# EAGLE board mcat-4cu-b-V2J (EAGLE 6.6.0)
DATECODE: 201406201445; PN: MCAT-4CU-B; REV: 2J
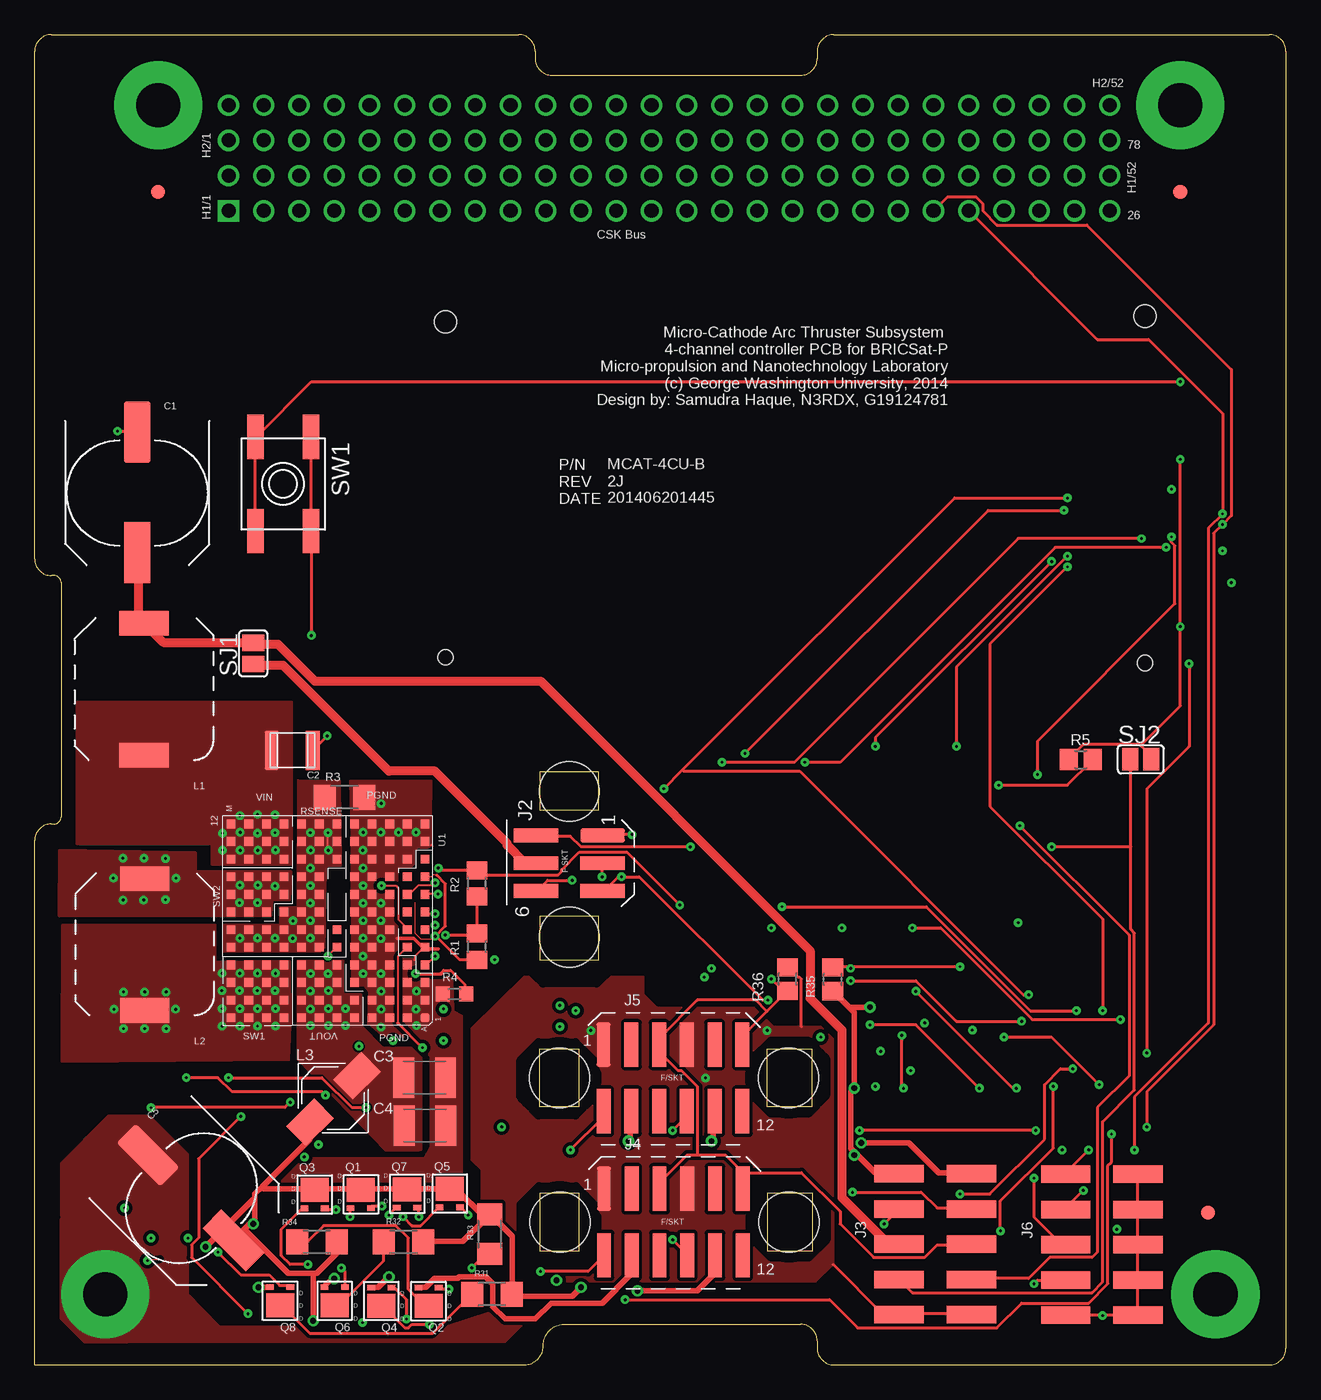
[diagram p5: board, top side]
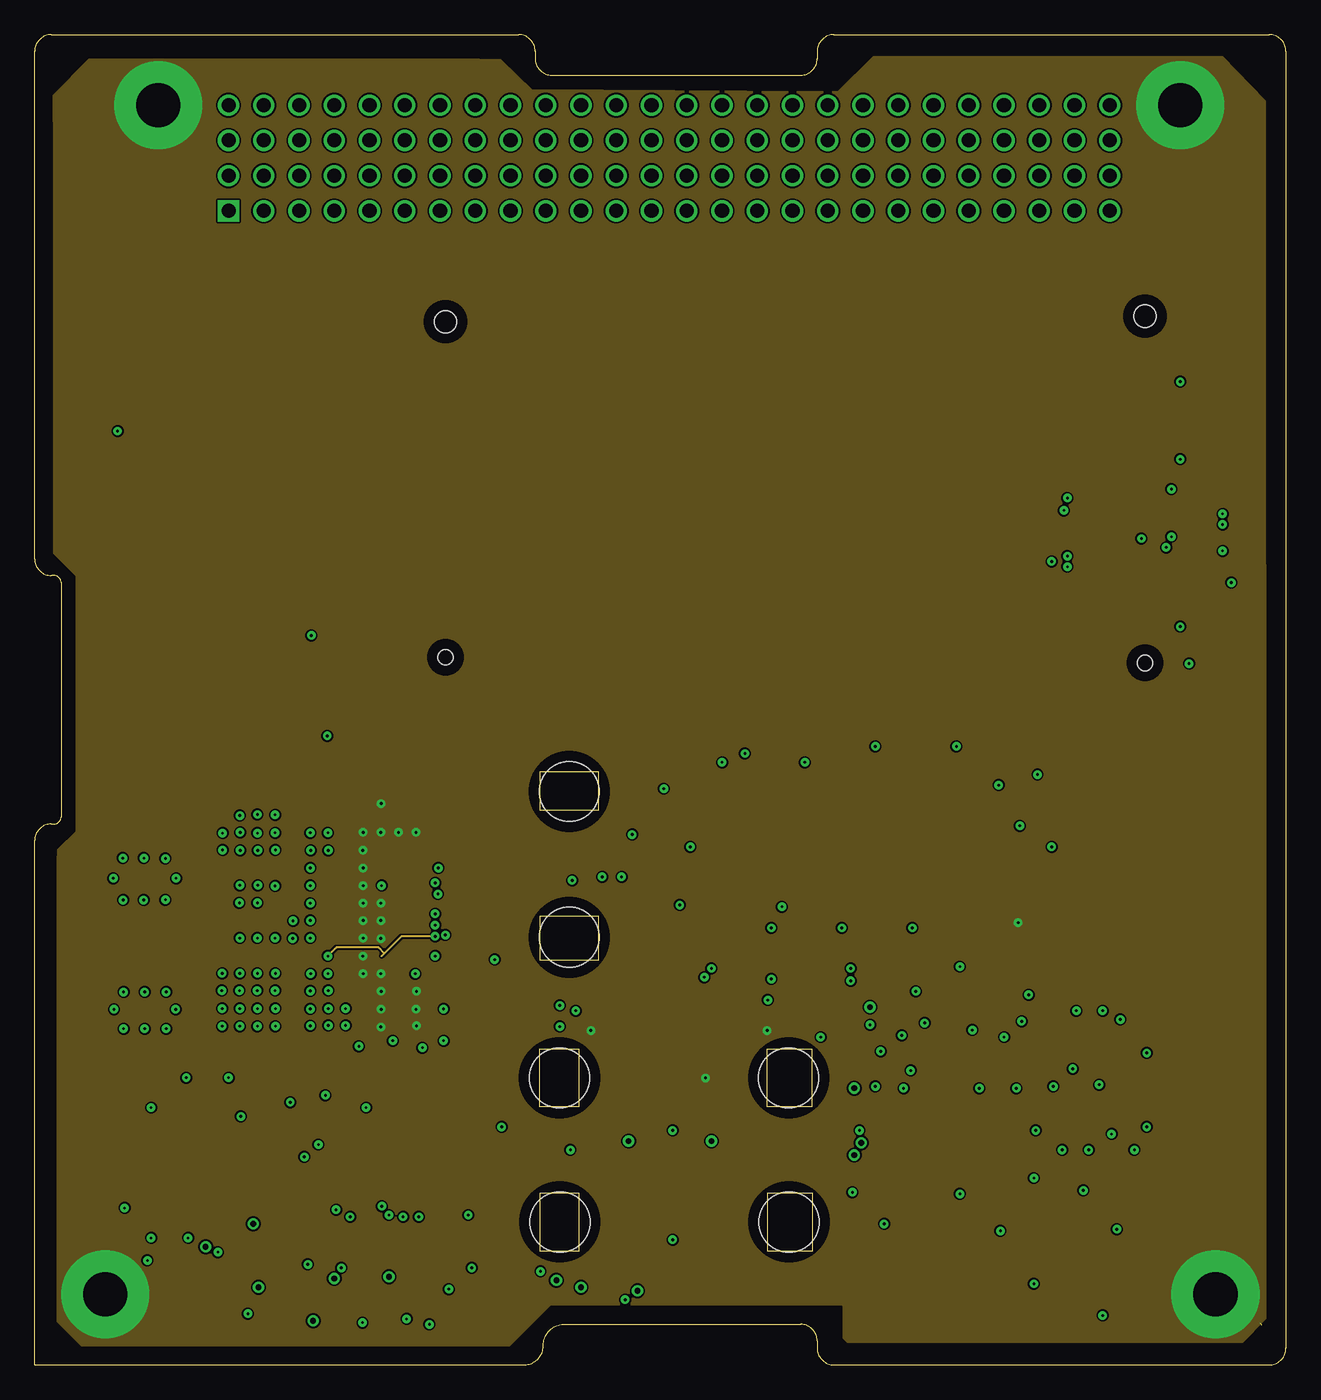
[diagram p6: board, inner layer GND_PLANE]
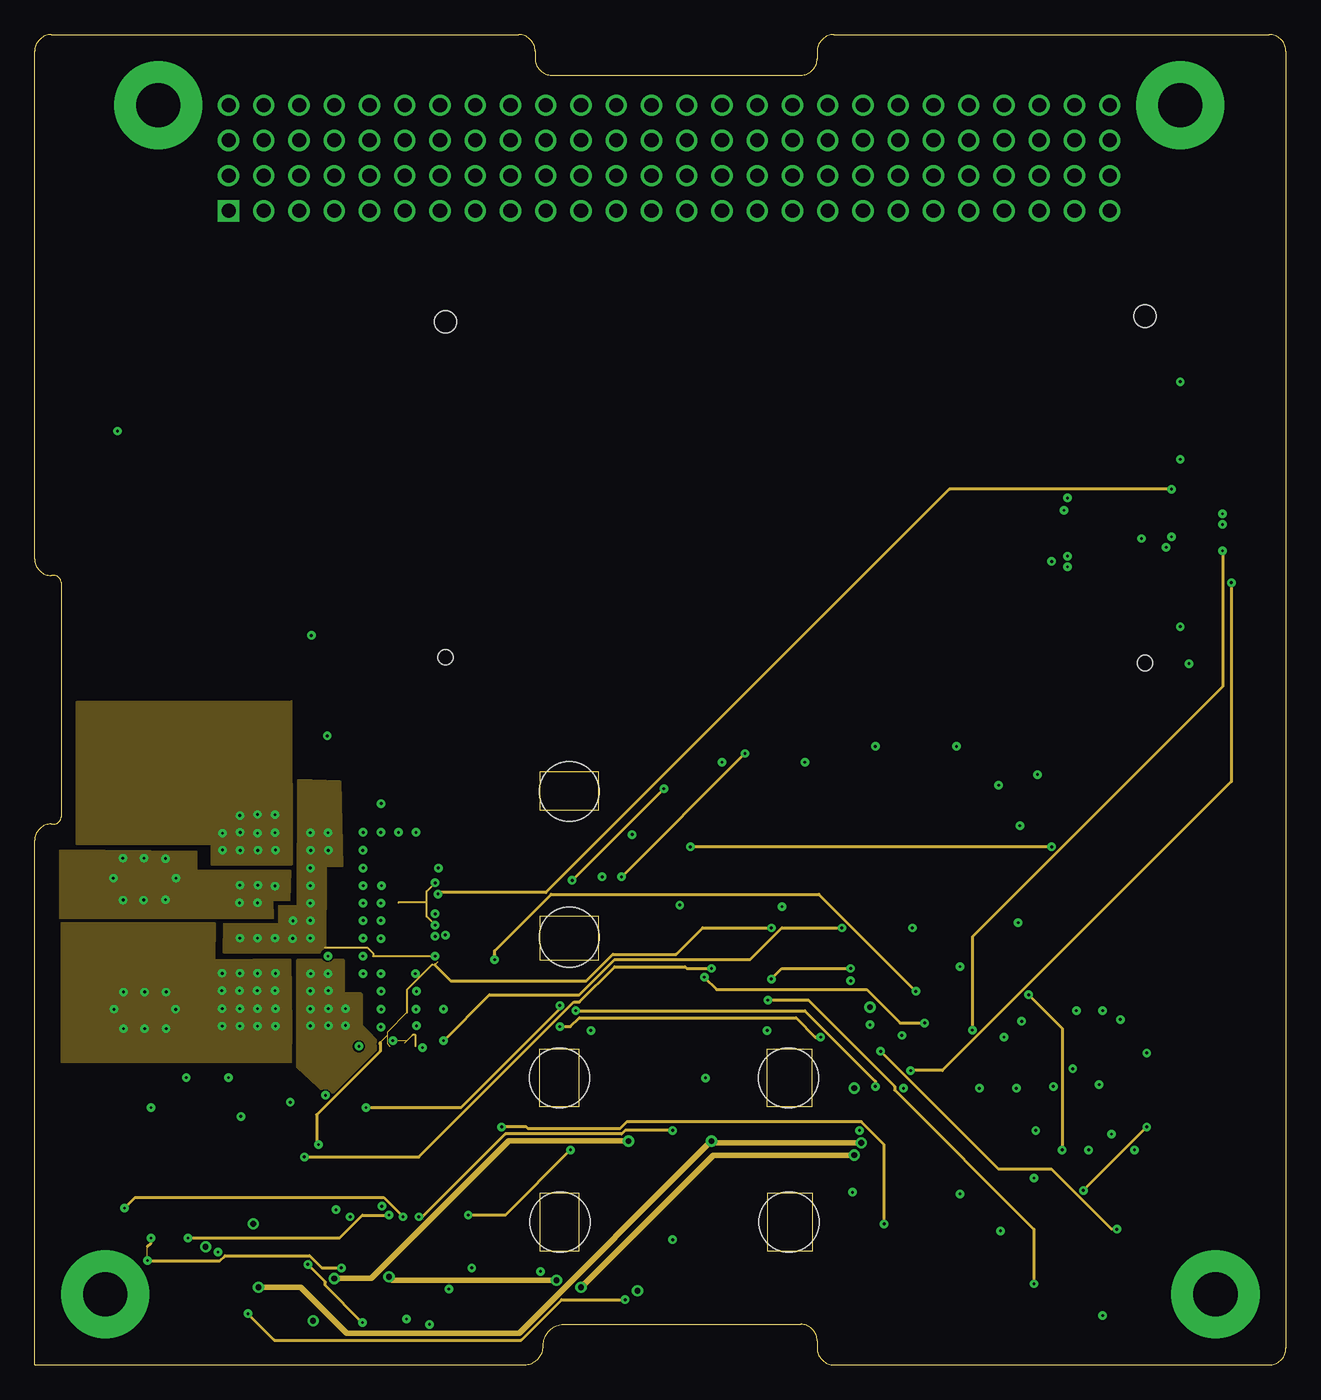
[diagram p7: board, inner layer GND_PLANE/TRACE]
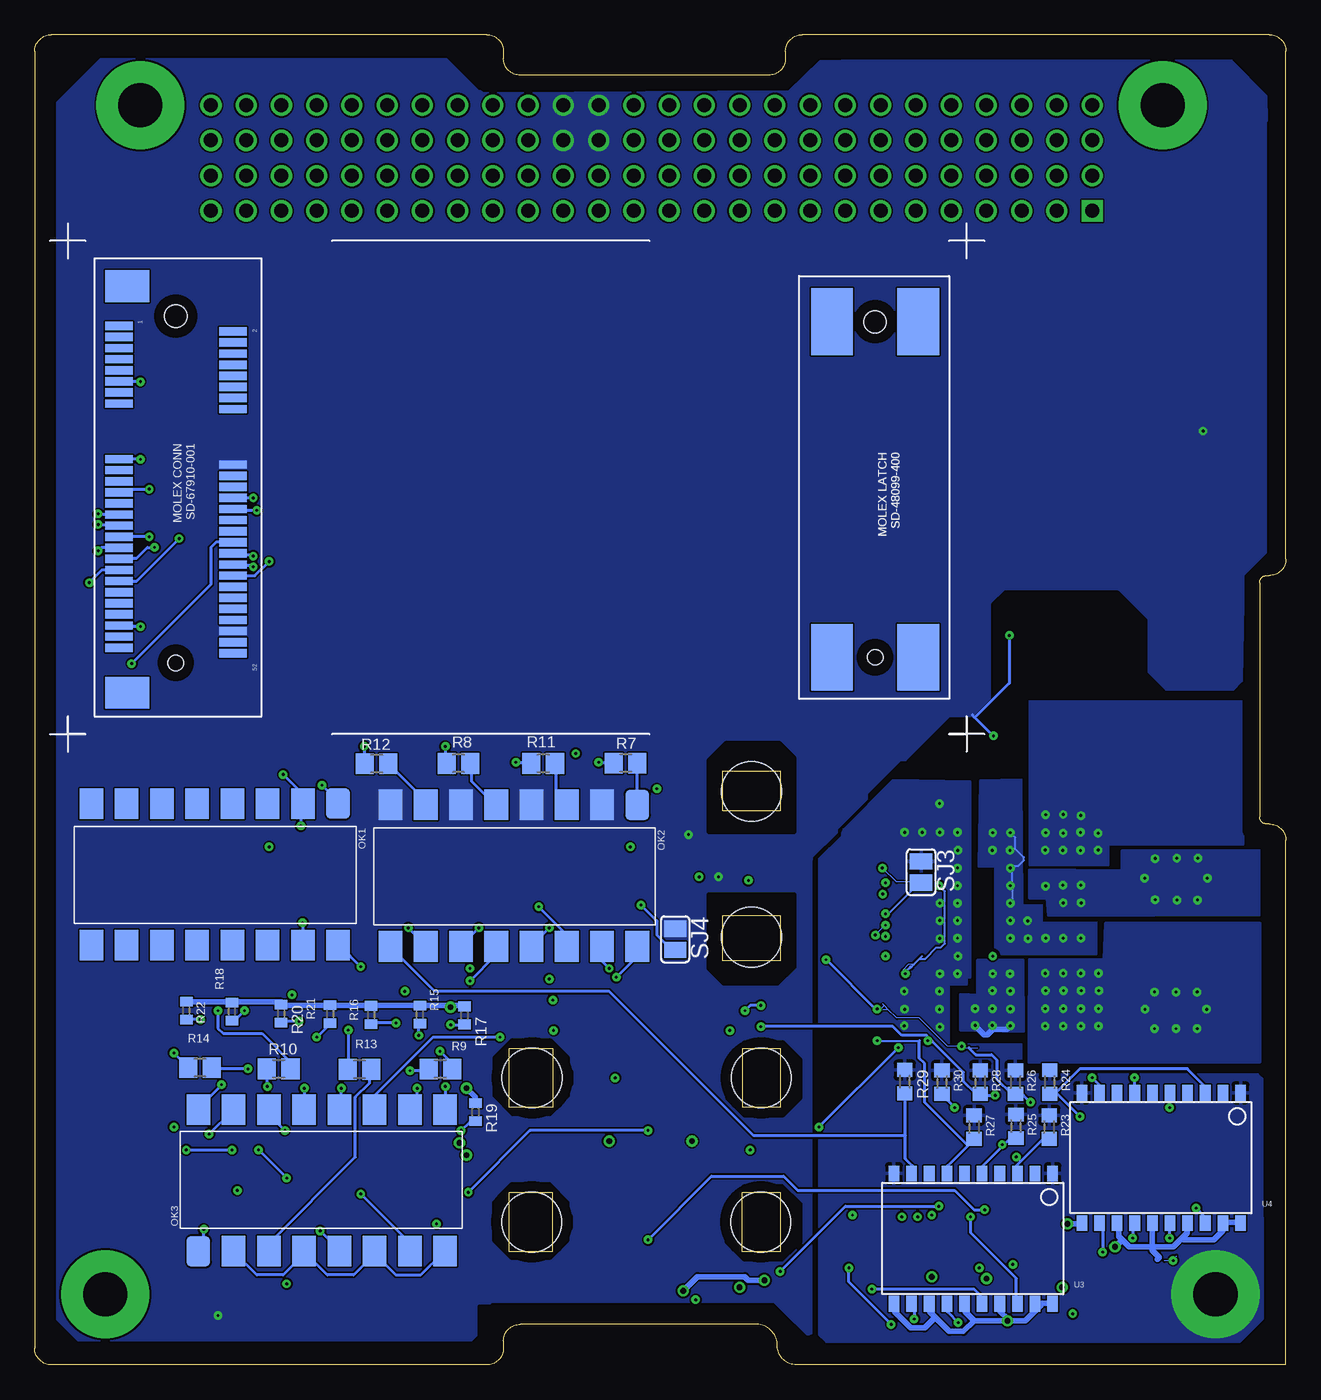
[diagram p8: board, bottom side, seen from below]

Size 90.17 x 95.89 mm. Coordinates in mm from the lower left corner, seen from the top.
Outline: 0,0 34.87,0 35.28,0 arc90 36.65,1.37 arc-90 38.12,2.92 55.19,2.92 arc-90 56.39,1.73 56.39,1.19 arc90 57.58,0 88.98,0 arc90 90.17,1.19 90.17,94.69 arc90 88.98,95.89 57.58,95.89 arc90 56.39,94.69 56.39,94.16 arc-90 55.19,92.96 37.26,92.96 arc-90 36.07,94.16 36.07,94.69 arc90 34.87,95.89 1.19,95.89 arc90 0,94.69 0,58.09 arc90 1.19,56.9 1.4,56.9 arc-90 1.91,56.39 1.91,39.5 arc-90 1.4,38.99 1.19,38.99 arc90 0,37.8 0,0
Copper layers (1+2*15+16): Top 0.0174mm / dielectric 3.5mil / GND_PLANE 0.0174mm / dielectric 47mil / GND_PLANE/TRACE 0.0174mm / dielectric 3.5mil / Bottom 0.0174mm
Design rules "mcat-4cu-b-v2g *": minimum track width 8mil, minimum drill 8mil, track to track 5mil, track to pad 5mil, pad to pad 5mil, via to via 5mil, smd to smd 5mil, copper to edge 30mil, drill to drill 10mil, minimum pad ring 8mil, minimum via ring 8mil, stop-mask expansion 0mil, vias tented up to drill 8mil, thermal gap 10mil
Net classes: 1 vout1: width 0.381 mm, drill 0.406 mm; 2 vin2: width 0.635 mm, drill 0.66 mm
tRestrict: 27 lines
bRestrict: 31 lines

## Footprints (pad centres in the part's own frame; a part is rotated, then mirrored left to right if it is on the bottom)
OS-CON-SVPF-F12 = smd 1.9 x 4.4: A1 0,-4.3; K1 0,4.4
MLCC-X7R-1210 = smd 1 x 2.8: 1 1.6,0.05; 2 -1.35,0.05
C1210K = smd 1.5 x 2.9: 1 -1.5,0; 2 1.5,0
FIDUCIAL_1MM = smd 1 x 1: 1 0,0
CSK-BUS-PKG = drill 1.016 pad 1.524 square: 1 -29.21,-3.81 | drill 1.016 pad 1.524: 2 -29.21,-1.27; 3 -26.67,-3.81; 4 -26.67,-1.27; 5 -24.13,-3.81; 6 -24.13,-1.27; 7 -21.59,-3.81; 8 -21.59,-1.27; 9 -19.05,-3.81; 10 -19.05,-1.27; 11 -16.51,-3.81; 12 -16.51,-1.27; 13 -13.97,-3.81; 14 -13.97,-1.27; 15 -11.43,-3.81; 16 -11.43,-1.27; 17 -8.89,-3.81; 18 -8.89,-1.27; 19 -6.35,-3.81; 20 -6.35,-1.27; 21 -3.81,-3.81; 22 -3.81,-1.27; 23 -1.27,-3.81; 24 -1.27,-1.27; 25 1.27,-3.81; 26 1.27,-1.27; 27 3.81,-3.81; 28 3.81,-1.27; 29 6.35,-3.81; 30 6.35,-1.27; 31 8.89,-3.81; 32 8.89,-1.27; 33 11.43,-3.81; 34 11.43,-1.27; 35 13.97,-3.81; 36 13.97,-1.27; 37 16.51,-3.81; 38 16.51,-1.27; 39 19.05,-3.81; 40 19.05,-1.27; 41 21.59,-3.81; 42 21.59,-1.27; 43 24.13,-3.81; 44 24.13,-1.27; 45 26.67,-3.81; 46 26.67,-1.27; 47 29.21,-3.81; 48 29.21,-1.27; 49 31.75,-3.81; 50 31.75,-1.27; 51 34.29,-3.81; 52 34.29,-1.27; 53 -29.21,1.27; 54 -29.21,3.81; 55 -26.67,1.27; 56 -26.67,3.81; 57 -24.13,1.27; 58 -24.13,3.81; 59 -21.59,1.27; 60 -21.59,3.81; 61 -19.05,1.27; 62 -19.05,3.81; 63 -16.51,1.27; 64 -16.51,3.81; 65 -13.97,1.27; 66 -13.97,3.81; 67 -11.43,1.27; 68 -11.43,3.81; 69 -8.89,1.27; 70 -8.89,3.81; 71 -6.35,1.27; 72 -6.35,3.81; 73 -3.81,1.27; 74 -3.81,3.81; 75 -1.27,1.27; 76 -1.27,3.81; 77 1.27,1.27; 78 1.27,3.81; 79 3.81,1.27; 80 3.81,3.81; 81 6.35,1.27; 82 6.35,3.81; 83 8.89,1.27; 84 8.89,3.81; 85 11.43,1.27; 86 11.43,3.81; 87 13.97,1.27; 88 13.97,3.81; 89 16.51,1.27; 90 16.51,3.81; 91 19.05,1.27; 92 19.05,3.81; 93 21.59,1.27; 94 21.59,3.81; 95 24.13,1.27; 96 24.13,3.81; 97 26.67,1.27; 98 26.67,3.81; 99 29.21,1.27; 100 29.21,3.81; 101 31.75,1.27; 102 31.75,3.81; 103 34.29,1.27; 104 34.29,3.81
M80-68106 = smd 1 x 3.2: 1 -2,2.4; 2 0,2.4; 3 2,2.4; 4 -2,-2.4; 5 0,-2.4; 6 2,-2.4 | hole 4.318: -5.175,0; 5.335,0
AMPMODU-SMT-PIN-HEADER-5X2 = smd 1.27 x 3.556: 1 -4.826,2.54; 2 -2.286,2.54; 3 0.254,2.54; 4 2.794,2.54; 5 5.334,2.54; 6 -4.826,-2.667; 7 -2.286,-2.667; 8 0.254,-2.667; 9 2.794,-2.667; 10 5.334,-2.667
M80-68112 = smd 1 x 3.2: 1 0,2.4; 2 2,2.4; 3 4,2.4; 4 6,2.4; 5 8,2.4; 6 10,2.4; 7 0,-2.4; 8 2,-2.4; 9 4,-2.4; 10 6,-2.4; 11 8,-2.4; 12 10,-2.4 | hole 4.318: -3.175,0; 13.335,0
LATCH_SD-48099-400 = smd 4.8 x 3: P$3 12.25,24.6; P$4 -11.95,24.6; P$5 -11.95,30.8; P$6 12.25,30.8 | hole 1.6: -11.95,27.7 | hole 1.1: 12.25,27.7
CONN_SD-67910-001 = smd 0.6 x 2: 1 -11.65,-26.8; 2 -11.248,-18.576; 3 -10.85,-26.8; 4 -10.447,-18.576; 5 -10.05,-26.8; 6 -9.648,-18.576; 7 -9.25,-26.8; 8 -8.848,-18.576; 9 -8.45,-26.8; 10 -8.047,-18.576; 11 -7.65,-26.8; 12 -7.247,-18.576; 13 -6.85,-26.8; 14 -6.447,-18.576; 15 -6.05,-26.8; 16 -5.647,-18.576; 17 -2.05,-26.8; 18 -1.647,-18.576; 19 -1.25,-26.8; 20 -0.848,-18.576; 21 -0.45,-26.8; 22 -0.048,-18.576; 23 0.35,-26.8; 24 0.752,-18.576; 25 1.15,-26.8; 26 1.552,-18.576; 27 1.95,-26.8; 28 2.353,-18.576; 29 2.75,-26.8; 30 3.152,-18.576; 31 3.55,-26.8; 32 3.953,-18.576; 33 4.35,-26.8; 34 4.753,-18.576; 35 5.15,-26.8; 36 5.553,-18.576; 37 5.95,-26.8; 38 6.353,-18.576; 39 6.75,-26.8; 40 7.152,-18.576; 41 7.55,-26.8; 42 7.952,-18.576; 43 8.35,-26.8; 44 8.752,-18.576; 45 9.15,-26.8; 46 9.553,-18.576; 47 9.95,-26.8; 48 10.352,-18.576; 49 10.75,-26.8; 50 11.152,-18.576; 51 11.55,-26.8; 52 11.953,-18.576 | smd 2.3 x 3.2: P$1 -14.5,-26.2; P$2 14.8,-26.2 | hole 1.6: -12.35,-22.7 | hole 1.1: 12.65,-22.7
MSS1048 = smd 3.56 x 1.78: 1 5,9.85; 2 5,0.35
SERIES-POWER-INDUCTORS = smd 2.85 x 2 rotated 45: 1 1.75,1.6; 2 -1.65,-1.75
PS2501L-4 = smd 2.2 x 1.7: 1 -1.6,19.03; 2 -1.6,16.49; 3 -1.6,13.95; 4 -1.6,11.41; 5 -1.6,8.87; 6 -1.6,6.33; 7 -1.6,3.79; 8 -1.6,1.25; 9 8.6,1.25; 10 8.6,3.79; 11 8.6,6.33; 12 8.6,8.87; 13 8.6,11.41; 14 8.6,13.95; 15 8.6,16.49; 16 8.6,19.03
1206-8-CHIPFET = smd 2.032 x 1.727: D 0,1.321 | smd 0.559 x 0.406: G -0.736,0; S 0.736,0
R0805 = smd 1.3 x 1.5: 1 -0.95,0; 2 0.95,0
R1206 = smd 1.6 x 1.803: 1 -1.422,0; 2 1.422,0
R0603 = smd 1 x 1.1: 1 -0.85,0; 2 0.85,0
R0805' = smd 1.3 x 1.5: 1 -0.85,0; 2 0.85,0
R0402 = smd 0.7 x 0.9: 1 -0.65,0; 2 0.65,0
SJ = smd 1.168 x 1.6: 1 -0.762,0; 2 0.762,0
EVQ-Q2 = smd 3.2 x 1.2: A -3.4,-2; A' 3.4,-2; B -3.4,2; B' 3.4,2
LGA-141-LTC-05-08-1840-B = smd 0.63 x 0.63: A1 -7.116,-10.192; A2 -5.846,-10.192; A3 -4.576,-10.192; A4 -3.306,-10.192; A5 -2.036,-10.192; A6 -0.766,-10.192; A7 0.504,-10.192; A8 1.774,-10.192; A9 3.044,-10.192; A10 4.314,-10.192; A11 5.584,-10.192; A12 6.854,-10.192; B1 -7.116,-8.922; B2 -5.846,-8.922; B3 -4.576,-8.922; B4 -3.306,-8.922; B5 -2.036,-8.922; B6 -0.766,-8.922; B7 0.504,-8.922; B8 1.774,-8.922; B9 3.044,-8.922; B10 4.314,-8.922; B11 5.584,-8.922; B12 6.854,-8.922; C1 -7.116,-7.652; C2 -5.846,-7.652; C3 -4.576,-7.652; C4 -3.306,-7.652; C5 -2.036,-7.652; C6 -0.766,-7.652; C7 0.504,-7.652; C8 1.774,-7.652; C9 3.044,-7.652; C10 4.314,-7.652; C11 5.584,-7.652; C12 6.854,-7.652; D1 -7.116,-6.382; D2 -5.846,-6.382; D3 -4.576,-6.382; D4 -3.306,-6.382; D5 -2.036,-6.382; D6 -0.766,-6.382; D7 0.504,-6.382; D8 1.774,-6.382; D9 3.044,-6.382; D10 4.314,-6.382; D11 5.584,-6.382; D12 6.854,-6.382; E1 -7.116,-5.112; E2 -5.846,-5.112; E3 -4.576,-5.112; E4 -3.306,-5.112; E5 -2.036,-5.112; E6 -0.766,-5.112; E7 0.504,-5.112; E8 1.774,-5.112; E9 3.044,-5.112; E10 4.314,-5.112; E11 5.584,-5.112; E12 6.854,-5.112; F1 -7.116,-3.842; F2 -5.846,-3.842; F3 -4.576,-3.842; F4 -3.306,-3.842; F5 -2.036,-3.842; F6 -0.766,-3.842; F10 4.314,-3.842; F11 5.584,-3.842; F12 6.854,-3.842; G1 -7.116,-2.572; G2 -5.846,-2.572; G3 -4.576,-2.572; G4 -3.306,-2.572; G5 -2.036,-2.572; G6 -0.766,-2.572; G7 0.504,-2.572; G8 1.774,-2.572; G9 3.044,-2.572; G10 4.314,-2.572; G11 5.584,-2.572; G12 6.854,-2.572; H2 -5.846,-1.302; H3 -4.576,-1.302; H4 -3.306,-1.302; H5 -2.036,-1.302; H6 -0.766,-1.302; H7 0.504,-1.302; H8 1.774,-1.302; H9 3.044,-1.302; H10 4.314,-1.302; H11 5.584,-1.302; H12 6.854,-1.302; J5 -2.036,-0.032; J6 -0.766,-0.032; J7 0.504,-0.032; J8 1.774,-0.032; J9 3.044,-0.032; J10 4.314,-0.032; J11 5.584,-0.032; J12 6.854,-0.032; K5 -2.036,1.238; K6 -0.766,1.238; K7 0.504,1.238; K8 1.774,1.238; K9 3.044,1.238; K10 4.314,1.238; K11 5.584,1.238; K12 6.854,1.238; L5 -2.036,2.508; L6 -0.766,2.508; L7 0.504,2.508; L8 1.774,2.508; L9 3.044,2.508; L10 4.314,2.508; L11 5.584,2.508; L12 6.854,2.508; M5 -2.036,3.778; M6 -0.766,3.778; M7 0.504,3.778; M8 1.774,3.778; M9 3.044,3.778; M10 4.314,3.778; M11 5.584,3.778; M12 6.854,3.778; SW1@J1 -7.116,-0.032; SW1@J2 -5.846,-0.032; SW1@J3 -4.576,-0.032; SW1@J4 -3.306,-0.032; SW1@K1 -7.116,1.238; SW1@K2 -5.846,1.238; SW1@K3 -4.576,1.238; SW1@K4 -3.306,1.238; SW1@L1 -7.116,2.508; SW1@L2 -5.846,2.508; SW1@L3 -4.576,2.508; SW1@L4 -3.306,2.508; SW1@M1 -7.116,3.778; SW1@M2 -5.846,3.778; SW1@M3 -4.576,3.778; SW1@M4 -3.306,3.778; VOUT -7.116,-1.302
20-LEAD-PLASTIC-SO = smd 0.762 x 1.143: 1 0,0; 2 1.27,0; 3 2.54,0; 4 3.81,0; 5 5.08,0; 6 6.35,0; 7 7.62,0; 8 8.89,0; 9 10.16,0; 10 11.43,0; 11 11.43,9.398; 12 10.16,9.398; 13 8.89,9.398; 14 7.62,9.398; 15 6.35,9.398; 16 5.08,9.398; 17 3.81,9.398; 18 2.54,9.398; 19 1.27,9.398; 20 0,9.398

## Placement (x,y rotation side)
C1  68uF  [OS-CON-SVPF-F12]  7.39,62.84 0 top
C2  4.7uF  [MLCC-X7R-1210]  18.69,44.34 180 top
C3  10uF  [C1210K]  28.1,20.7 0 top
C4  10uF  [C1210K]  28.13,17.24 0 top
C5  68uF  [OS-CON-SVPF-F12]  11.29,12.01 45 top
FID1  FIDUCIAL  [FIDUCIAL_1MM]  84.56,10.97 0 top
FID2  FIDUCIAL  [FIDUCIAL_1MM]  8.89,84.56 0 top
FID3  FIDUCIAL  [FIDUCIAL_1MM]  82.55,84.56 0 top
J1  2 x ESQ-126-39-G-D  [CSK-BUS-PKG]  43.18,87 0 top
J2  M80-6810642  [M80-68106]  38.52,36.16 270 top
J3  AMPMODU5X2SMTHDR  [AMPMODU-SMT-PIN-HEADER-5X2]  64.83,8.44 90 top
J4  M80-6811242  [M80-68112]  41.02,10.3 0 top
J5  M80-6811242  [M80-68112]  41,20.68 0 top
J6  AMPMODU5X2SMTHDR  [AMPMODU-SMT-PIN-HEADER-5X2]  76.83,8.41 90 top
J7  LATCH_NANO55415_MODULE  [LATCH_SD-48099-400]  57.3,63.25 270 bottom
J9  CONN_NANO55415_MODULE  [CONN_SD-67910-001]  57.3,63.25 270 bottom
L1  33uH  [MSS1048]  2.89,43.6 0 top
L2  330uH  [MSS1048]  2.93,25.2 0 top
L3  10uH  [SERIES-POWER-INDUCTORS]  21.48,19.23 0 top
OK1  PS2501L-4  [PS2501L-4]  87.34,38.86 270 bottom
OK2  PS2501L-4  [PS2501L-4]  65.78,38.76 270 bottom
OK3  PS2501L-4  [PS2501L-4]  59.34,9.79 90 bottom
Q1  SI5404BDC  [1206-8-CHIPFET]  23.5,11.31 0 top
Q2  SI5404BDC  [1206-8-CHIPFET]  28.39,5.58 180 top
Q3  SI5404BDC  [1206-8-CHIPFET]  20.17,11.28 0 top
Q4  SI5404BDC  [1206-8-CHIPFET]  24.98,5.58 180 top
Q5  SI5404BDC  [1206-8-CHIPFET]  29.9,11.35 0 top
Q6  SI5404BDC  [1206-8-CHIPFET]  21.62,5.61 180 top
Q7  SI5404BDC  [1206-8-CHIPFET]  26.83,11.33 0 top
Q8  SI5404BDC  [1206-8-CHIPFET]  17.69,5.61 180 top
R1  3K79  [R0805]  31.88,30.15 90 top
R2  1K  [R0805]  31.87,34.7 90 top
R3  70mOhms  [R1206]  22.33,40.9 0 top
R4  4k70.1%  [R0603]  30.26,26.73 0 top
R5  1K  [R0805']  75.38,43.63 0 top
R7  5K42  [R0805']  47.58,43.37 180 bottom
R8  5K42  [R0805']  59.63,43.36 180 bottom
R9  5K42  [R0805']  60.94,21.32 180 bottom
R10  5K42  [R0805']  72.59,21.34 0 bottom
R11  5K42  [R0805']  53.53,43.35 180 bottom
R12  5K42  [R0805']  65.53,43.33 180 bottom
R13  5K420.1%  [R0805']  66.77,21.3 180 bottom
R14  5K420.1%  [R0805']  78.26,21.42 180 bottom
R15  100k  [R0402]  62.42,25.24 270 bottom
R16  100k  [R0402]  65.92,25.22 270 bottom
R17  100k  [R0402]  59.2,25.19 270 bottom
R18  100k  [R0402]  75.96,25.46 270 bottom
R19  100k  [R0402]  58.41,18.22 270 bottom
R20  100k  [R0402]  72.41,25.31 270 bottom
R21  100k  [R0402]  68.87,25.28 270 bottom
R22  100k  [R0402]  79.24,25.53 270 bottom
R23  51k  [R0603]  17.07,17.14 270 bottom
R24  51k  [R0603]  17.03,20.39 270 bottom
R25  51k  [R0603]  19.46,17.19 270 bottom
R26  51k  [R0603]  19.5,20.37 270 bottom
R27  51k  [R0603]  22.48,17.13 270 bottom
R28  51k  [R0603]  22.04,20.37 270 bottom
R29  51k  [R0603]  27.47,20.41 270 bottom
R30  51k  [R0603]  24.79,20.37 270 bottom
R31  0.1R  [R1206]  32.95,5.1 0 top
R32  0.1R  [R1206]  26.58,8.86 0 top
R33  0.1R  [R1206]  32.78,9.44 90 top
R34  0.1R  [R1206]  20.34,8.86 0 top
R35  180R  [R0805']  57.51,27.79 90 top
R36  1K  [R0805']  54.25,27.81 90 top
SJ1  0R  [SJ]  15.75,51.28 90 top
SJ2  0R  [SJ]  79.7,43.65 0 top
SJ3  0R  [SJ]  26.3,35.52 270 bottom
SJ4  0R  [SJ]  44.02,30.68 270 bottom
SW1  SPST_TACT-EVQQ2  [EVQ-Q2]  17.91,63.5 270 top
U1  LTM4609MPV#PBF  [LGA-141-LTC-05-08-1840-B]  17.93,32.14 90 top
U3  LT1161ISW  [20-LEAD-PLASTIC-SO]  16.82,13.79 180 bottom
U4  LT1161ISW  [20-LEAD-PLASTIC-SO]  3.28,19.61 180 bottom

## Tracks (layer width: path | path; a pad name or v marks a point on that pad's centre or on a via)
!RSTI  (via drill 0.2)
  Top 0.203: v82.55,70.87 19.94,70.87 16,66.93 SW1.A 15.88,66.8 15.88,60.2 SW1.A'
  Bottom 0.203: v82.55,70.87 84.07,70.87 J9.11
CH1_P18H
  Top 0.381: Q2.S 27.69,5.59 28.19,5.59 28.83,6.22 30.48,6.22 30.61,6.35 32.51,6.35 33.02,5.84 33.02,4.19 33.91,3.3 36.07,3.3 37.21,4.45 40.89,4.45 42.93,6.48 42.93,7.87 J4.8
CH1_P18L  (via drill 0.2)
  Top 0.203: v25.02,11.43 24.26,11.43 Q1.S | v36.45,6.73 39.88,6.73 41.02,7.87 J4.7
  Bottom 0.203: v25.02,11.43 31.75,11.43 v36.45,6.73
CH1HG  (via drill 0.2)
  Top 0.203: v29.84,5.46 29.21,5.46 Q2.G
  Bottom 0.203: v29.84,5.46 22.48,5.46 21.97,4.95 21.97,4.45 U3.16
CH1LG  (via drill 0.2)
  Top 0.203: v22.73,10.67 22.73,11.3 Q1.G
  Bottom 0.203: v22.73,10.67 22.73,9.53 19.43,6.22 19.43,4.45 U3.18
CH1S
  Top 0.203: R34.1 18.92,8.89 19.68,8.89 20.83,10.03 26.04,10.03 26.92,9.14 26.92,5.46 28.07,4.32 28.32,4.32 Q2.D
CH2_P18H  (via drill 0.41)
  Top 0.381: v25.53,6.35 24.77,5.59 24.26,5.59 Q4.S | v43.43,5.33 47.75,5.33 49.02,6.6 49.02,7.87 J4.11
  GND_PLANE/TRACE 0.381: v25.53,6.35 25.78,6.1 v37.59,6.1
  Bottom 0.381: v37.59,6.1 38.73,6.1 38.99,6.35 42.42,6.35 v43.43,5.33
CH2_P18L  (via drill 0.2)
  Top 0.203: v21.72,11.18 20.95,11.18 Q3.S | v45.97,9.02 46.99,8 J4.10
  Bottom 0.203: v21.72,11.18 22.48,11.18 23.88,12.57 35.18,12.57 36.2,13.59 41.4,13.59 v45.97,9.02
CH2HG  (via drill 0.2)
  Top 0.203: v26.8,3.3 26.8,4.7 26.04,5.46 25.78,5.46 Q4.G
  Bottom 0.203: v26.8,3.3 26.8,4.19 26.92,4.32 U3.12
CH2LG  (via drill 0.2)
  Top 0.203: v19.68,7.24 18.41,7.24 17.78,7.87 17.78,9.78 19.18,11.18 19.43,11.18 Q3.G
  GND_PLANE/TRACE 0.203: v19.68,7.24 20.95,5.97 20.95,5.71 v23.62,3.05
  Bottom 0.203: v23.62,3.05 24.38,3.81 24.38,4.32 U3.14
CH2S  (via drill 0.2)
  Top 0.203: v31.5,6.99 32.51,8 32.77,8 R33.1 | v28.45,2.92 27.18,2.92 26.92,2.67 26.67,2.67 25.02,4.32 Q4.D
  Bottom 0.203: v31.5,6.99 31.5,5.97 v28.45,2.92
CH3_P18H  (via drill 0.41)
  Top 0.381: v21.59,6.22 21.46,6.22 20.95,5.71 Q6.S | v42.8,16.13 42.93,16.26 42.93,18.16 J5.8
  GND_PLANE/TRACE 0.381: v21.59,6.22 24.26,6.22 34.16,16.13 v42.8,16.13
CH3_P18L  (via drill 0.2)
  Top 0.203: v31.24,10.79 30.73,11.3 Q5.S | v38.61,15.49 40.89,17.78 40.89,18.16 J5.7
  GND_PLANE/TRACE 0.203: v31.24,10.79 33.91,10.79 v38.61,15.49
CH3HG  (via drill 0.2)
  Top 0.051: 9.02,7.62 8.13,7.62 v8.13,7.52
  Top 0.203: v22.1,6.99 22.35,6.73 22.35,5.71 Q6.G
  GND_PLANE/TRACE 0.051: v8.13,7.52 8.13,8.51 8.13,8.56
  GND_PLANE/TRACE 0.203: 8.13,8.51 8.38,8.76 v8.38,9.14 | v22.1,6.99 20.7,6.99 19.81,7.87 13.72,7.87 13.34,7.49 8.13,7.49 v8.13,7.52
  Bottom 0.051: v8.13,7.52 7.92,7.52 | 7.87,7.87 8.13,7.62 v8.13,7.52 | 8.76,7.49 8.13,7.49 v8.13,7.52
  Bottom 0.203: v8.38,9.14 8.38,10.16 U4.16
CH3LG  (via drill 0.2)
  Top 0.203: v26.54,10.67 27.18,10.03 27.81,10.03 29.08,11.3 Q5.G
  GND_PLANE/TRACE 0.203: v26.54,10.67 25.15,12.06 7.24,12.06 v6.48,11.3
  Bottom 0.203: v6.48,11.3 5.84,10.67 5.84,10.29 U4.18
CH3S
  Top 0.203: R32.1 25.15,8.76 25.15,7.49 21.97,4.32 21.72,4.32 Q6.D
CH4_P18H  (via drill 0.41)
  Top 0.381: v16.13,5.59 16.89,5.59 Q8.S | v48.77,16.13 48.9,16.26 48.9,18.16 J5.11 | v59.56,16 62.99,16 65.15,13.84 67.44,13.84 J3.10
  GND_PLANE/TRACE 0.381: v16.13,5.59 19.18,5.59 22.48,2.29 34.92,2.29 v48.77,16.13 48.9,16 v59.56,16
CH4_P18L  (via drill 0.2)
  Top 0.203: v27.69,10.67 27.69,11.3 Q7.S | v45.97,16.89 46.99,17.91 46.99,18.16 J5.10 | v58.93,12.45 63.88,12.45 65.02,11.3 67.44,11.3 J3.9
  GND_PLANE/TRACE 0.203: v27.69,10.67 27.94,10.67 33.91,16.64 42.29,16.64 42.55,16.89 v45.97,16.89
  Bottom 0.203: v58.93,12.45 54.48,16.89 v45.97,16.89
CH4HG  (via drill 0.2)
  Top 0.203: v13.21,8.13 14.86,6.48 16.89,6.48 17.65,5.71 18.41,5.71 Q8.G
  Bottom 0.203: v13.21,8.13 13.21,10.03 13.34,10.16 U4.12
CH4LG  (via drill 0.2)
  Top 0.203: v25.53,10.79 26.04,11.3 Q7.G
  GND_PLANE/TRACE 0.203: v25.53,10.79 23.62,10.79 21.97,9.14 v11.05,9.14
  Bottom 0.203: v11.05,9.14 11.05,10.03 10.92,10.16 U4.14
CH4S
  Top 0.203: R31.1 31.5,5.08 28.7,2.29 19.81,2.29 17.78,4.32 Q8.D
GBD
  Bottom 0.203: 65.66,8 65.79,8.13 OK3.6 65.66,8 | 65.66,8 64.14,6.48 62.36,6.48 60.71,8.13 OK3.8 | 65.66,8 67.18,6.48 69.09,6.48 70.74,8.13 OK3.4 70.74,8 72.26,6.48 74.17,6.48 75.82,8.13 OK3.2
GND  (via drill 0.2)
  Top 0.203: J6.1 74.3,3.56 v76.96,3.56 79.5,3.56 J6.6 J6.7 J6.8 J6.9 J6.10 | v21.08,45.34 20.07,44.32 C2.2 | v19.94,52.58 19.94,60.07 SW1.B' 19.94,60.2 19.94,66.8 SW1.B | v40.89,35.18 40.89,36.07 J2.2 | v43.05,38.23 41.02,38.23 J2.1 | v5.97,67.31 7.37,67.31 C1.K1
  Bottom 0.203: 22.61,46.86 22.42,46.67 | 22.42,46.67 v21.08,45.34 | 22.42,46.67 19.94,49.15 v19.94,52.58
  pour Bottom (isolate 0.127, rank 2, no thermals): 34.2,36.16 34.2,2.25 34.76,2.01 37.15,4.4 58.2,4.4 58.35,4.25 58.35,1.95 58.6,1.7 87,1.7 88.65,3.35 88.65,57.65 88.6,57.7 88.6,91.1 85.53,94.25 60.47,94.22 57.94,91.75 56.49,91.7 35.79,91.85 33.56,94.02 32,94.05 3.95,94.05 1.43,91.48 1.4,89.65 1.45,89.6 1.45,58.5 3.05,56.9 3.17,49.28 3.81,48.64 8.64,48.64 9.91,49.91 9.91,53.72 12.06,55.88 20.32,55.88 21.34,54.86 21.34,48.01 22.61,46.74 24.26,46.74 27.43,43.56 27.81,43.56 30.23,41.15 30.23,40.77 32.38,38.61 32.38,38.35 34.16,36.58
I2C(CLK)  (via drill 0.2)
  Top 0.203: J1.43 76.58,73.91 80.26,73.91 85.6,68.58 v85.6,61.34 84.58,60.33 84.58,24.64 79.25,19.3 v79.25,15.49 | v75.95,15.49 74.3,13.84 J6.5
  Bottom 0.203: v85.6,61.34 84.2,61.34 J9.27 | v79.25,15.49 v75.95,15.49
I2C(DATA)  (via drill 0.2)
  Top 0.203: J1.41 65.79,84.2 67.82,84.2 68.33,83.69 68.33,83.19 69.34,82.17 75.82,82.17 86.23,71.75 86.23,61.21 v85.6,60.58 84.96,59.94 84.96,24.51 80.14,19.68 v80.14,17.14 | v75.56,12.57 74.3,11.3 J6.4
  GND_PLANE/TRACE 0.203: v80.14,17.14 v75.56,12.57
  Bottom 0.203: v85.6,60.58 84.2,60.58 J9.29
INTVCC  (via drill 0.2)
  Top 0.051: 27.43,33.33 27.43,31.09 27.84,30.68 28.85,30.68 v28.85,30.89 | 28.96,35.31 28.7,35.31 28.57,35.18 28.19,35.18 U1.A9
  Top 0.152: v21.13,29.46 21.74,30.07 U1.F5 | 28.25,35.36 U1.A9
  Top 0.203: 28.96,35.31 29.59,34.67 29.59,31.62 v28.85,30.89 28.96,30.86 30.61,29.21 R1.1
  GND_PLANE 0.152: 25.2,29.67 26.42,30.89 v28.85,30.89 | 25.2,29.67 24.99,29.46 | v21.13,29.46 21.74,30.07 24.79,30.07 25.2,29.67
N$4  (via drill 0.2)
  GND_PLANE/TRACE 0.203: v64.14,24.64 62.36,24.64 59.94,27.05 49.15,27.05 v48.26,27.94
  Bottom 0.203: v64.14,24.64 65.91,24.64 R16.2 | v48.26,27.94 46.86,29.34 46.86,30.1 OK2.16
N$5  (via drill 0.2)
  Top 0.203: v75.06,25.53 71.75,25.53 64.26,33.02 v53.85,33.02
  Bottom 0.203: v75.06,25.53 75.69,24.89 75.95,24.89 R18.2 | v53.85,33.02 51.94,31.11 51.94,30.23 OK2.14
N$7  (via drill 0.2)
  Top 0.203: v71.12,24.77 66.42,24.77 63.5,27.69 v58.8,27.69
  Bottom 0.203: v71.12,24.77 72.39,24.77 R20.2 | v58.8,27.69 57.02,29.46 57.02,30.1 OK2.12
N$9  (via drill 0.2)
  Top 0.203: v78.23,24.89 71.88,24.89 65.28,31.5 v63.25,31.5
  Bottom 0.203: v78.23,24.89 79.12,24.89 R22.2 | v63.25,31.5 61.98,30.23 OK2.10
N$10  (via drill 0.2)
  Top 0.203: v69.85,23.62 73.28,23.62 v76.71,20.19
  Bottom 0.203: v69.85,23.62 68.96,24.51 R21.2 | v76.71,20.19 78.49,18.41 OK3.16
N$11  (via drill 0.2)
  Top 0.203: v72.14,16.89 v59.44,16.89
  Bottom 0.203: v59.44,16.89 58.8,17.53 58.42,17.53 R19.2 | v72.14,16.89 73.28,18.03 73.28,18.29 OK3.14
N$12  (via drill 0.2)
  Top 0.203: v60.2,24.51 63.5,24.51 v68.07,19.94
  Bottom 0.203: v60.2,24.51 59.31,24.51 R17.2 | v68.07,19.94 68.07,18.54 68.2,18.41 OK3.12
N$13  (via drill 0.2)
  Top 0.203: v62.48,23.75 62.48,20.07 v62.61,19.94
  Bottom 0.203: v62.48,23.75 62.48,24.51 R15.2 | v62.61,19.94 62.61,18.92 63.12,18.41 OK3.10
N$16  (via drill 0.2)
  Top 0.203: v69.47,41.78 74.42,41.78 76.2,43.56 R5.2
  Bottom 0.203: v69.47,41.78 68.2,40.51 OK1.1
OK1E1  (via drill 0.2)
  GND_PLANE/TRACE 0.203: v48.77,28.57 46.99,28.57 46.86,28.7 41.78,28.7 39.24,26.16 38.86,26.16 27.69,14.99 v19.43,14.99
  Bottom 0.203: 19.11,14.67 19.43,14.35 19.43,13.84 U3.3 | 19.11,14.67 17.53,16.26 17.14,16.26 R23.2 | v48.77,28.57 49.28,29.08 49.28,30.1 OK2.15 | 19.11,14.67 v19.43,14.99
OK1E2  (via drill 0.2)
  GND_PLANE/TRACE 0.051: 25.6,22.96 25.4,23.16 25.4,23.75 | 25.4,23.75 25.4,23.98 26.82,25.4 | 28.65,28.85 28.7,28.83 28.83,28.83 29.08,29.08 | 25.4,23.75 24.89,23.24 24.77,23.11
  GND_PLANE/TRACE 0.152: 26.82,25.4 26.82,27.03 28.65,28.85
  GND_PLANE/TRACE 0.203: v53.09,31.5 48.13,31.5 46.23,29.59 41.66,29.59 39.75,27.69 29.97,27.69 28.83,28.83 | v20.45,15.88 20.32,16 20.32,18.03 24.89,22.61 24.89,23.24
  Bottom 0.203: 20.38,15.81 21.84,14.35 21.84,13.84 U3.5 | 20.38,15.81 19.94,16.26 19.56,16.26 R25.2 | v53.09,31.5 54.36,30.23 OK2.13 | v20.45,15.88 20.38,15.81
OK1E3  (via drill 0.2)
  GND_PLANE/TRACE 0.203: v58.17,31.5 53.85,31.5 51.56,29.21 41.78,29.21 39.24,26.67 32.77,26.67 v29.46,23.37
  Bottom 0.152: v29.46,23.37 26.42,23.37
  Bottom 0.203: U3.7 24.38,13.84 24.38,14.35 22.48,16.26 R27.2 22.99,15.88 26.04,18.92 26.04,21.72 26.42,22.1 26.42,23.37 | v58.17,31.5 59.44,30.23 OK2.11
OK1E4
  Bottom 0.203: 27.43,16.51 27.43,14.86 26.92,14.35 26.92,13.84 U3.9 | 27.43,16.51 27.43,19.43 R29.2 | 27.43,16.51 38.35,16.51 48.77,26.92 61.34,26.92 64.52,30.1 OK2.9
OK2E1  (via drill 0.2)
  Top 0.203: v77.6,16.64 77.6,14.61 77.34,14.35 77.34,5.84 75.95,4.45 71.12,4.45 69.34,2.67 59.31,2.67 57.28,4.7 v42.55,4.7 | v15.37,3.68 11.3,7.75 11.3,8.64 11.81,9.14 11.81,14.86 v14.86,17.91
  GND_PLANE/TRACE 0.203: v42.55,4.7 37.97,4.7 35.05,1.78 17.27,1.78 v15.37,3.68
  Bottom 0.203: U4.3 5.84,19.68 5.84,20.07 7.11,21.34 14.86,21.34 16.64,19.56 17.02,19.56 R24.2 16.51,19.56 v14.86,17.91 | v77.6,16.64 75.95,18.29 OK3.15
OK2E2  (via drill 0.2)
  Top 0.203: v8.38,18.54 18.03,18.54 v18.41,18.92 | v70.74,19.94 70.48,19.94 v63.5,26.92
  GND_PLANE/TRACE 0.203: v63.5,26.92 56.52,33.91 37.21,33.91 33.15,29.84 v33.15,29.21
  Bottom 0.051: 28.65,25.6 28.04,24.99 26.42,24.99 24.38,22.96 v23.37,22.96 23.37,22.86 22.86,22.86 22.23,22.86 | 28.65,25.6 28.96,25.91 | 28.96,25.91 29.06,26.01 | 28.65,25.6 29.06,25.6 | 28.96,25.91 29.34,25.53
  Bottom 0.203: 29.34,25.53 v29.46,25.65 29.46,25.53 v33.15,29.21 | 22.86,22.86 22.35,22.35 21.21,22.35 20.83,21.97 20.83,20.57 19.81,19.56 19.56,19.56 R26.2 19.43,19.43 18.92,19.43 v18.41,18.92 | v8.38,18.54 8.38,19.56 U4.5 | v70.74,19.94 70.74,18.41 OK3.13
OK2E3  (via drill 0.2)
  Top 0.203: v10.92,20.7 13.21,20.7 14.22,19.68 20.7,19.68 v20.95,19.43
  GND_PLANE/TRACE 0.051: 27.23,23.77 26.82,23.37 | 26.82,23.37 26.62,23.16 | 26.82,23.37 v25.81,23.37
  GND_PLANE/TRACE 0.152: 27.23,23.77 27.43,23.77 27.43,22.96
  GND_PLANE/TRACE 0.203: v56.64,23.62 56.26,23.62 54.86,25.02 39.24,25.02 38.61,24.38 v37.85,24.38
  Bottom 0.203: 25.53,23.37 23.24,21.08 23.24,20.45 22.35,19.56 22.1,19.56 R28.2 21.97,19.43 v20.95,19.43 | v10.92,20.7 10.92,19.68 U4.7 | v56.64,23.62 61.47,23.62 65.66,19.43 65.66,18.41 OK3.11 | v37.85,24.38 28.32,24.38 27.69,23.75 25.91,23.75 25.53,23.37 | 25.53,23.37 v25.81,23.37
OK2E4  (via drill 0.2)
  Top 0.203: v23.88,18.54 22.86,18.54 20.7,20.7 v13.97,20.7
  GND_PLANE/TRACE 0.203: v60.58,20.07 60.58,20.45 55.5,25.53 v38.99,25.53 | v37.85,25.91 37.85,25.65 30.73,18.54 v23.88,18.54
  Bottom 0.203: v23.88,18.54 24.77,19.43 R30.2 | v13.97,20.7 13.46,20.19 13.46,19.68 U4.9 | v60.58,20.07 60.58,18.41 OK3.9 | v38.99,25.53 38.61,25.91 v37.85,25.91
P3  (via drill 0.2)
  Top 0.203: 79.69,44.64 80.39,43.94 80.39,43.69 SJ2.2 | 79.69,44.64 79.63,44.7 75.56,44.7 74.55,43.69 R5.1 | 79.69,44.64 82.55,47.5 v82.55,53.21 v82.55,65.28
  Bottom 0.203: v82.55,53.21 84.07,53.21 J9.47 | v82.55,65.28 84.07,65.28 J9.17
P3_SW  (via drill 0.2)
  Top 0.203: 78.99,37.34 78.99,31.37 79.25,31.11 79.25,19.81 76.96,17.53 76.96,5.97 76.2,5.21 63.25,5.21 62.36,6.1 J3.2 | 78.99,37.34 78.99,43.56 SJ2.1 | v47.24,37.34 39.37,37.34 38.61,38.1 36.2,38.1 J2.4 | 78.99,37.34 v73.28,37.34
  GND_PLANE/TRACE 0.203: v73.28,37.34 v47.24,37.34
P18_SW1
  Bottom 0.203: R7.1 46.74,43.31 46.74,40.39 OK2.1
P18_SW2
  Bottom 0.203: R8.1 58.67,43.31 58.67,42.04 57.02,40.39 OK2.5
P18_SW3  (via drill 0.2)
  GND_PLANE/TRACE 0.203: v60.96,22.61 69.47,14.1 73.28,14.1 77.6,9.78 v77.98,9.78
  Bottom 0.203: v60.96,22.61 60.2,21.84 60.2,21.34 R9.1 | v77.98,9.78 77.98,8.64 78.36,8.26 OK3.1
P18_SW4  (via drill 0.2)
  Top 0.203: v73.41,20.07 73.41,15.62 69.6,11.81 v69.6,9.65
  Bottom 0.203: v73.41,20.07 73.41,21.34 R10.1 | v69.6,9.65 68.2,8.26 OK3.5
P18_SW5
  Bottom 0.203: R11.1 52.58,43.31 52.58,41.15 51.82,40.39 OK2.3
P18_SW6
  Bottom 0.203: R12.1 64.64,43.31 62.1,40.77 62.1,40.39 OK2.7
P18_SW7
  Bottom 0.203: R13.1 66.04,21.21 66.04,20.32 67.06,19.3 67.06,14.99 73.28,8.76 73.28,8.26 OK3.3
P18_SW8  (via drill 0.2)
  Top 0.203: v74.8,21.34 73.91,21.34 72.77,20.19 72.77,16.26 68.83,12.32 v66.67,12.32
  Bottom 0.203: v74.8,21.34 77.34,21.34 R14.1 | v66.67,12.32 63.25,8.89 63.25,8.26 OK3.7
PBATT_SW
  Top 0.635: SJ1.1 15.88,50.42 17.91,50.42 25.53,42.8 28.83,42.8 34.04,37.59 34.04,37.47 35.31,36.2 36.07,36.2 J2.5
PGND  (via drill 0.2, 0.2 pad 0.51, 3.17 pad 6.35)
  Top 0.051: 26.82,24.79 U1.B1 26.67,24.77
  Top 0.152: v5.08,5.08 5.08,4.32 | v5.08,5.08 6.86,6.86 | 6.91,6.91 v5.08,5.08 | U1.A5 28.04,30.07 27.43,29.46 27.43,29.26 27.36,29.18 | 28.65,37.39 28.55,37.47
  Top 0.203: J3.6 67.44,3.68 62.36,3.68 J3.1 62.23,3.68 61.09,3.68 57.53,7.24 | 55.24,24.38 55.24,27.81 55.12,27.94 54.99,27.94 54.36,28.57 R36.2
  Top 0.254: 26.14,30.73 27.3,30.73 28.07,29.97 29.08,29.97
  GND_PLANE 0.051: 88.39,2.85 88.39,2.92 88.31,3.01
  Bottom 0.203: v70.87,31.88 70.87,30.35 OK1.15
  other vias: 85.09,5.08 8.89,90.81 27.48,38.38 26.21,38.38 24.94,38.38 23.67,38.38 23.65,37.08 23.67,35.81 23.67,34.54 23.67,33.27 24.94,33.27 23.67,32.03 24.94,32.03 23.67,30.76 24.94,30.73 23.67,28.19 24.94,28.19 24.97,26.92 24.97,25.63 23.65,29.46 24.94,24.36 27.51,26.92 27.48,25.63 27.51,24.43 24.97,40.46 82.55,90.81 52.78,24.1 48.34,20.68 40.08,24.1
  pour GND_PLANE (isolate 0.127, no thermals): 3.4,1.45 34.2,1.45 37.15,4.4 58.2,4.4 58.35,4.25 58.35,1.95 58.6,1.7 87,1.7 88.65,3.35 88.65,57.65 88.6,57.7 88.6,91.1 85.53,94.25 60.47,94.22 57.94,91.75 56.49,91.7 35.79,91.85 33.56,94.02 32,94.05 3.95,94.05 1.43,91.48 1.4,89.65 1.45,89.6 1.45,58.5 3.05,56.9 3.08,38.41 1.75,37.13 1.75,36.75 1.7,36.6 1.7,3.15
  pour Top (isolate 0.254, no thermals): 6.63,1.47 3.71,1.47 1.75,3.43 1.75,14.43 5.31,17.98 8.26,17.98 11.02,15.21 11.02,5.11 13.28,2.77 29.77,2.82 32.87,3.81 33.12,4.37 33.12,8.86 32.89,9.09 32.89,9.78 32.21,10.46 32.21,14.05 31.5,14.76 31.5,24.28 35.28,27.99 43.87,27.99 43.87,26.75 44.83,25.78 51.82,25.78 53.21,24.38 56.64,24.38 57.53,23.5 57.53,7.24 56.26,5.97 36.96,5.97 36.2,5.21 36.17,3.91 33.88,1.63 6.71,1.63 6.58,1.5
  pour Top (isolate 0.254, no thermals): 22.83,38.1 22.74,42.11 28.58,42.11 28.55,39.24 28.55,37.47 28.35,37.26 27.51,37.26 27.3,37.06 27.3,36.07 27.13,35.89 26.34,35.89 26.14,35.69 26.14,29.57 26.39,29.31 27.23,29.31 27.41,29.13 27.41,28.32 27.64,28.09 29.67,28.07 30.1,27.71 30.18,25.5 30.76,25.17 30.76,8.08 29.41,6.73 21.62,6.73 17.83,10.52 17.83,13.28 19.46,14.91 28.12,14.91 28.55,15.7 28.52,22.2 27.25,23.65 25.35,23.65 25.27,23.72 25.02,23.77 24.03,24.61 24.1,26.92 23.77,27.3 22.89,27.33
  pour Bottom: 2.03,20.95 19.05,20.95 19.05,23.11 24.26,23.11 24.26,27.43 22.99,27.43 22.99,27.94 22.73,27.94 22.73,42.04 28.32,42.16 31.88,38.61 32,38.35 32,38.1 33.66,36.45 33.66,2.16 33.15,1.65 3.3,1.65 1.65,3.3 1.65,20.57
PGOOD_PMA  (via drill 0.2)
  Top 0.152: 26.21,24.59 26.21,24.64 26.21,29.46 26.82,30.07 U1.B5
  Top 0.203: v27.94,22.86 26.16,24.64 26.21,24.64 | v61.21,10.16 62.23,11.18 J3.4
  GND_PLANE/TRACE 0.203: v33.66,17.14 35.43,17.14 35.56,17.02 42.16,17.02 42.67,17.53 59.56,17.53 61.21,15.88 v61.21,10.16
  Bottom 0.203: v33.66,17.14 v27.94,22.86
RSENSE  (via drill 0.2, 0.2 pad 0.51)
  Top 0.152: v28.85,29.46 28.25,28.85 U1.A4 | v21.13,38.35 21.13,37.19 v21.16,37.08
  GND_PLANE/TRACE 0.152: v28.85,29.46 24.38,29.46 24.38,29.67 23.98,30.07 20.93,30.07
  Bottom 0.152: v19.86,38.35 19.51,38 19.51,37.19 | 19.51,37.19 19.71,37.19 v19.89,37.08 | 19.71,34.54 19.71,33.33 v19.86,33.27 | 19.71,34.54 19.71,35.76 v19.86,35.81 19.71,35.97 19.3,35.97 18.9,36.37 18.9,36.58 19.51,37.19 | 19.71,34.54 v19.86,34.54
  other vias: 14.78,30.76 16.05,30.76 17.32,30.76 18.59,30.73 19.86,30.76 18.62,32 19.86,32.03
  pour Bottom (isolate 0.25, no thermals): 13.63,31.86 17.56,31.86 17.56,33.13 18.96,33.16 19.04,42.21 22.05,42.11 22.18,35.93 20.98,35.91 20.98,29.63 13.63,29.63
  pour Top (isolate 0.25, no thermals): 13.63,31.73 17.71,31.73 17.66,33.01 18.96,33.06 18.98,42.17 21.98,42.14 22.05,35.93 20.98,35.91 20.88,29.76 13.63,29.76
  pour GND_PLANE/TRACE (isolate 0.25, no thermals): 13.66,31.81 17.63,31.78 17.61,33.08 18.96,33.08 18.99,42.19 22,42.09 22.18,35.93 20.98,35.91 20.93,29.71 13.63,29.71
SETFREQ  (via drill 0.2)
  Top 0.051: 28.96,31.62 v28.85,31.7
  Top 0.152: v28.85,34.75 28.85,34.54 27.64,34.54 27.03,33.93 U1.B8
  Top 0.203: R2.1 31.88,33.66 31.88,31.11 R1.2 31.88,30.99 v29.59,30.99
  GND_PLANE/TRACE 0.152: 28.25,33.33 26.21,33.33 | 28.25,33.33 28.25,32.31 v28.85,31.7 | v28.85,34.75 28.25,34.14 28.25,33.33
  Bottom 0.051: v29.59,30.99 28.96,31.62 v28.85,31.7
SGND  (via drill 0.2)
  Top 0.152: U1.A7 28.25,32.51 v28.85,32.51 28.85,32.31
  Top 0.203: v29.08,35.81 29.21,35.69 31.75,35.69 R2.2 31.88,35.56 32.13,35.31 37.72,35.31 37.97,35.56 37.97,35.69 39.24,36.96 42.67,36.96 v46.48,33.15
  Bottom 0.051: v29.08,35.81 28.07,34.8 26.42,34.8 SJ3.2
  Bottom 0.152: v28.85,32.51 28.65,32.51 26.42,34.75 SJ3.2
  Bottom 0.203: v46.48,33.15 45.34,32 45.34,30.99 44.32,29.97 44.07,29.97 SJ4.2
SW1  (via drill 0.2 pad 0.51)
  other vias: 14.78,24.41 16.05,24.41 17.35,24.41 13.51,24.41 6.4,24.23 9.47,24.23 7.92,24.23 5.71,25.63 10.16,25.63 6.4,26.87 9.47,26.87 7.92,26.87 14.78,25.68 16.05,25.68 17.35,25.68 13.51,25.68 14.78,28.22 16.05,28.22 17.35,28.22 13.51,28.22 14.76,26.97 16.03,26.97 17.32,26.97 13.49,26.97
  pour Bottom (no thermals): 18.47,29.24 13.08,29.18 13,31.83 1.91,31.83 1.91,21.84 18.49,21.79 18.52,24.41 18.47,28.85
  pour GND_PLANE/TRACE (isolate 0.127, no thermals): 18.44,29.21 12.98,29.16 13,31.83 1.91,31.83 1.91,21.84 18.49,21.79 18.52,24.41
  pour Top (no thermals): 13.06,29.03 13.06,31.7 1.96,31.7 1.93,21.84 18.34,21.97 18.44,24.46 18.41,29.11
SW2  (via drill 0.2 pad 0.51)
  other vias: 6.38,33.5 9.42,33.53 7.85,33.5 9.42,36.5 6.35,36.53 7.87,36.53 10.19,35.08 5.66,35.08 14.78,34.57 16.08,34.57 14.76,33.3 16.05,33.3 17.32,34.52
  pour Top (no thermals): 11.56,35.56 11.58,36.91 1.8,37.08 1.78,32.41 16.99,32.41 17.07,33.55 18.34,33.53 18.47,35.53
  pour GND_PLANE/TRACE (no thermals): 11.68,35.64 11.68,36.98 1.8,37.08 1.8,32.21 17.2,32.21 17.17,33.5 18.39,33.48 18.44,35.61
  pour Bottom (isolate 0.254, no thermals): 11.81,35.61 11.81,37.03 1.8,37.08 1.8,32.46 17.09,32.41 17.2,33.66 18.47,33.66 18.47,35.66
SW_P18H1  (via drill 0.2)
  Top 0.203: v55.5,43.43 58.04,43.43 73.53,58.93 v81.53,58.93
  Bottom 0.203: v55.5,43.43 54.48,43.43 R11.2 | v81.53,58.93 82.04,58.93 82.8,58.17 84.07,58.17 J9.35
SW_P18H2  (via drill 0.2)
  Top 0.203: v66.42,44.58 66.42,50.29 v74.42,58.29
  Bottom 0.203: v66.42,44.58 66.42,43.43 R12.2 | v74.42,58.29 74.55,58.42 75.82,58.42 J9.34
SW_P18H3  (via drill 0.2)
  GND_PLANE/TRACE 0.203: v67.56,24.13 67.56,30.86 85.6,48.9 v85.6,58.67
  Bottom 0.203: v67.56,24.13 67.56,21.34 R13.2 | v85.6,58.67 85.34,58.93 84.2,58.93 J9.33
SW_P18H4  (via drill 0.2)
  Top 0.203: v80.14,22.48 80.14,41.53 83.19,44.58 v83.19,50.55
  Bottom 0.203: v80.14,22.48 79.12,21.46 R14.2 | v83.19,50.55 77.47,56.26 77.47,58.93 77.09,59.31 75.95,59.31 J9.32
SW_P18L1  (via drill 0.2)
  Top 0.203: v49.53,43.43 54.74,43.43 70.87,59.56 v79.76,59.56
  Bottom 0.203: v49.53,43.43 48.51,43.43 R7.2 | v79.76,59.56 82.8,56.52 84.07,56.52 J9.39
SW_P18L2  (via drill 0.2)
  Top 0.203: v60.58,44.58 60.58,45.21 v73.28,57.91
  Bottom 0.203: v60.58,44.58 60.58,43.43 R8.2 | v73.28,57.91 74.3,56.9 75.82,56.9 J9.38
SW_P18L3  (via drill 0.2)
  GND_PLANE/TRACE 0.203: v63.12,21.21 65.41,21.21 86.23,42.04 v86.23,56.39
  Bottom 0.203: v63.12,21.21 61.85,21.21 R9.2 | v86.23,56.39 85.34,57.28 84.2,57.28 J9.37
SW_P18L4  (via drill 0.2)
  Top 0.203: v76.96,25.53 76.96,32.13 68.83,40.26 68.83,51.94 v74.42,57.53
  Bottom 0.203: v76.96,25.53 76.96,24.26 76.58,23.88 73.79,23.88 71.75,21.84 71.75,21.46 R10.2 | v74.42,57.53 74.55,57.66 75.82,57.66 J9.36
SW_RUNPMA  (via drill 0.2)
  Top 0.152: v29.06,33.93 28.25,33.93 U1.A8
  GND_PLANE/TRACE 0.203: v81.92,63.12 65.91,63.12 36.83,34.04 29.08,34.04 v29.06,33.93
  Bottom 0.203: v81.92,63.12 83.95,63.12 84.07,62.99 J9.23
SW_TP1  (via drill 0.2)
  Top 0.203: v81.92,59.69 81.92,59.31 82.17,59.05 82.17,54.86 72.26,44.96 v72.26,42.55 | v70.99,38.86 78.87,30.99 78.87,20.83 76.58,18.54 76.58,8.13 76.2,7.75 73.15,7.75 71.63,6.22 67.56,6.22 J3.7
  Bottom 0.203: v81.92,59.69 84.07,59.69 J9.31 | v72.26,42.55 70.87,41.15 70.87,40.51 OK1.2 70.99,41.15 v70.99,38.86
TP1_OUT  (via drill 0.2)
  Top 0.203: 47.75,15.11 49.78,15.11 50.93,13.97 50.93,13.84 | 47.75,15.11 46.99,15.11 45.09,13.21 45.09,12.7 J4.3 | 50.93,13.84 50.93,12.7 J4.6 50.93,13.84 | 50.93,13.84 55.24,13.84 58.04,11.05 58.04,10.16 60.45,7.75 64.14,7.75 65.02,8.64 67.44,8.64 J3.8 | v66.67,28.7 58.8,28.7 | 58.8,28.7 57.53,28.7 R35.2 | 52.77,25.46 51.05,23.75 51.05,23.11 J5.6 | 52.77,25.46 54.1,26.8 | 54.1,26.8 54.23,26.92 R36.1 54.1,26.8 | 52.77,25.46 51.94,26.29 47.75,26.29 45.09,23.62 45.09,23.11 J5.3 45.09,22.99 45.09,22.48 46.35,21.21 46.61,21.21 47.75,20.07 47.75,15.11 | v58.8,28.57 58.8,28.7 | 54.1,26.8 v53.09,27.81
  GND_PLANE/TRACE 0.203: v58.8,28.57 53.85,28.57 v53.09,27.81
  Bottom 0.203: v66.67,28.7 68.2,30.23 OK1.16
UART0_RX  (via drill 0.2)
  Top 0.203: v74.42,62.48 66.29,62.48 46.67,42.86 | v45.34,41.53 46.67,42.86 | v38.73,34.92 36.96,34.92 36.2,34.16 J2.6 | v72.01,13.46 72.01,10.67 73.91,8.76 74.3,8.76 J6.3 | v71.63,26.67 71.25,26.67 55.12,42.8 46.74,42.8 46.67,42.86
  GND_PLANE/TRACE 0.203: v38.73,34.92 v45.34,41.53 | v74.04,15.49 74.04,24.26 v71.63,26.67
  Bottom 0.203: v74.42,62.48 75.82,62.48 J9.24 | v74.04,15.49 v72.01,13.46
UART0_TX  (via drill 0.2)
  Top 0.203: v74.17,61.59 68.71,61.59 v51.18,44.07 | J2.3 41.02,34.16 42.04,35.18 v42.29,35.18 43.56,35.18 52.45,26.29 v52.83,26.29 | v72.01,5.84 72.26,6.1 74.3,6.1 J6.2
  GND_PLANE/TRACE 0.203: v42.29,35.18 v51.18,44.07 | v72.01,5.84 72.01,9.78 61.98,19.81 61.98,20.07 55.75,26.29 v52.83,26.29
  Bottom 0.203: v74.17,61.59 75.82,61.59 J9.26
VBATT_IN
  Top 0.635: J3.3 62.23,8.76 61.47,8.76 58.17,12.06 58.17,24.13 55.88,26.42 55.88,29.84 36.45,49.28 20.19,49.28 17.53,51.94 16,51.94 SJ1.2 15.75,52.07 9.27,52.07 8,53.34 L1.1 7.75,53.72 7.49,53.98 7.49,58.42 C1.A1
VFB  (via drill 0.2)
  Top 0.152: v24.99,34.54 26.01,34.54 26.21,34.34 26.21,32.11 26.82,31.5 U1.B6
  Top 0.203: v27.43,28.19 29.21,28.19 | 29.21,28.19 29.34,28.19 | 29.21,28.19 29.46,28.45 29.97,28.45 30.99,27.43 30.99,26.8 R4.2
  Bottom 0.051: 27.64,28.45 27.23,28.85 26.82,28.85
  Bottom 0.152: 27.03,28.65 27.01,28.66 26.82,28.85 26.42,29.26 | 26.42,29.26 26.21,29.46 | v24.99,34.54 24.59,34.14 24.59,30.37 24.88,30.07 25.2,30.07 26.01,29.26 26.42,29.26
  Bottom 0.203: v27.43,28.19 27.43,28.32 27.05,28.7 27.01,28.66
VIN  (via drill 0.2 pad 0.51)
  other vias: 14.81,38.38 16.05,38.33 17.32,38.35 14.81,37.08 16.08,37.08 17.35,37.11 13.54,38.33 13.54,37.11 14.78,39.6 16.05,39.67 17.32,39.65
  pour Bottom (isolate 0.254, no thermals): 18.52,36.04 12.78,36.02 12.78,37.47 3.05,37.52 3.05,47.8 18.49,47.85
  pour GND_PLANE/TRACE (no thermals): 18.52,36.04 12.78,36.02 12.78,37.47 3.05,37.52 3.05,47.8 18.49,47.85
  pour Top (no thermals): 18.52,36.04 12.78,36.02 12.78,37.47 3.05,37.52 3.05,47.8 18.52,47.83
VOUT  (via drill 0.2 pad 0.51)
  Bottom 0.406: v19.86,24.43 20.12,24.18 20.93,24.18 21.03,24.28 | 21.03,24.28 21.13,24.38 v21.16,24.46 | 21.03,24.28 21.54,23.77 21.74,23.77 22.35,24.38 v22.4,24.46
  other vias: 19.86,25.65 21.16,25.68 22.4,25.68 19.86,26.95 21.16,26.97 19.89,28.19 21.13,28.19
  pour Top (no thermals): 27.66,15.42 25.32,15.39 18.97,22.02 18.97,29.16 22.23,29.16 22.23,26.75 23.5,26.75 23.5,26.7 23.52,26.7 23.52,24.46 25.1,22.89 27.13,22.89 27.84,22.17 27.84,15.49
  pour GND_PLANE/TRACE (no thermals): 27.71,15.57 25.32,15.57 18.97,21.46 18.97,29.16 22.23,29.16 22.23,26.75 23.5,26.75 23.5,26.7 23.52,26.7 23.52,24.46 25.1,22.89 27.13,22.89 27.84,22.17 27.84,15.7
  pour Bottom (no thermals): 18.95,24.05 23.44,24.16 23.44,26.7 22.2,26.64 22.2,29.16 18.97,29.16
VOUTA  (via drill 0.41)
  Top 0.381: 58.8,25.65 57.53,26.92 R35.1 | 58.8,25.65 59.05,25.4 v59.05,19.94 58.8,19.68 58.8,15.62 59.18,15.24 | v60.2,25.78 58.93,25.78 58.8,25.65 | 59.18,15.24 60.58,13.84 62.23,13.84 J3.5 | R32.2 28.07,8.89 30.86,8.89 32.77,10.79 R33.2 | R33.2 32.89,10.79 34.42,9.27 34.42,5.21 R31.2 34.42,4.95 38.73,4.95 v39.37,5.59 | R33.2 32.38,10.67 30.35,12.7 30.1,12.7 Q5.D 29.84,12.7 26.92,12.7 Q7.D 26.67,12.7 23.62,12.7 Q1.D 23.5,12.7 20.19,12.7 Q3.D 20.07,12.7 16.51,12.7 16.38,12.83 | 15.11,9.78 14.35,9.02 C5.A1 | 15.11,9.78 15.49,10.16 v15.75,10.16 15.88,10.29 15.88,11.94 | 20.07,6.6 18.29,6.6 15.11,9.78 | 20.07,6.6 20.32,6.6 21.72,8 21.72,8.76 R34.2 | 16.38,12.83 15.88,12.32 15.88,11.94 | 16.38,12.83 19.81,16.26 19.81,17.4 L3.2 | v12.32,8.51 15.75,11.94 15.88,11.94 | 20.07,6.6 v20.07,3.17 | v59.05,15.11 59.18,15.24
  GND_PLANE/TRACE 0.381: v59.05,15.11 48.9,15.11 v39.37,5.59
  Bottom 0.381: 9.27,7.62 9.14,7.75 9.65,8.26 9.65,8.51 | R22.1 79.12,26.16 76.07,26.16 R18.1 75.82,26.16 72.39,26.16 R20.1 72.39,25.91 68.96,25.91 R21.1 68.83,25.91 66.04,25.91 R16.1 65.79,25.91 62.61,25.91 R15.1 62.36,25.91 60.2,25.91 | 60.2,25.91 59.31,25.91 R17.1 | v59.05,19.94 58.42,19.3 58.42,18.92 R19.1 | v60.2,25.78 60.2,25.91 | 17.65,4.45 18.03,4.45 U3.19 | 17.65,4.45 16.89,4.45 U3.20 | 20,3.24 19.94,3.17 18.8,3.17 17.65,4.32 17.65,4.45 | 20,3.24 20.07,3.3 | 20.07,3.3 20.57,3.81 20.57,4.32 U3.17 | 22.48,3.17 23.11,3.81 23.11,4.32 U3.15 | 22.48,3.17 20.19,3.17 20.07,3.3 | 25.27,3.43 24.26,2.41 23.24,2.41 22.48,3.17 | 25.27,3.43 25.65,3.81 25.65,4.32 U3.13 | 25.27,3.43 26.04,2.67 27.05,2.67 28.19,3.81 28.19,4.32 U3.11 | U4.20 3.3,10.29 4.45,10.29 U4.19 4.57,10.03 4.57,9.65 5.21,9.02 7.37,9.02 7.49,9.14 | 9.65,8.51 9.65,10.16 U4.15 | 7.49,9.14 8.13,8.51 9.65,8.51 | 7.49,9.14 7.11,9.53 7.11,10.16 U4.17 | 11.81,9.02 11.3,8.51 9.65,8.51 | 11.81,9.02 12.06,9.27 12.06,10.16 U4.13 | v15.75,10.16 14.73,10.16 U4.11 | v12.32,8.51 11.81,9.02 | v20.07,3.17 20,3.24

## Text on the board
tPlace: Micro-Cathode Arc Thruster Subsystem / 4-channel controller PCB for BRICSat-P / Micro-propulsion and Nanotechnology Laboratory / (c) George Washington University, 2014 / Design by: Samudra Haque, N3RDX, G19124781 | P/N / REV / DATE
tDocu: ^^^ | ^^^ | J2 / GND/GND/UART0_TX / P3_SW/PBATT_SW/UART0_RX | ^^^ | J3 / PGND/P3_SW2/VBATT_IN/PGOOD_PMA/VOUTA / PGND/SW_TP1/TP1_OUT/CH4_P18L/CH4_P18H | J6 / GND/UART0_TX/UART0_RX/I2C(DATA)/I2C(CLK) / GND/GND/GND/GND/GND